# Altium schematic sheet Схема преобразователя.SchDoc
size 304 x 215 mm; SheetNumber: 1; SheetTotal: 1; SPICEModelCacheYOZEOBVT: <root> / <DocumentId>YOZEOBVT</DocumentId> / </root>; Normo_kontr: Фамилия; Proveril: Фамилия; Razrabotal: Васильев; Title2: название схемы (2 строка); Utverdil: Вертегел; Doc_Type_1str: Схема электрическая; Doc_Type_2str: принципиальная
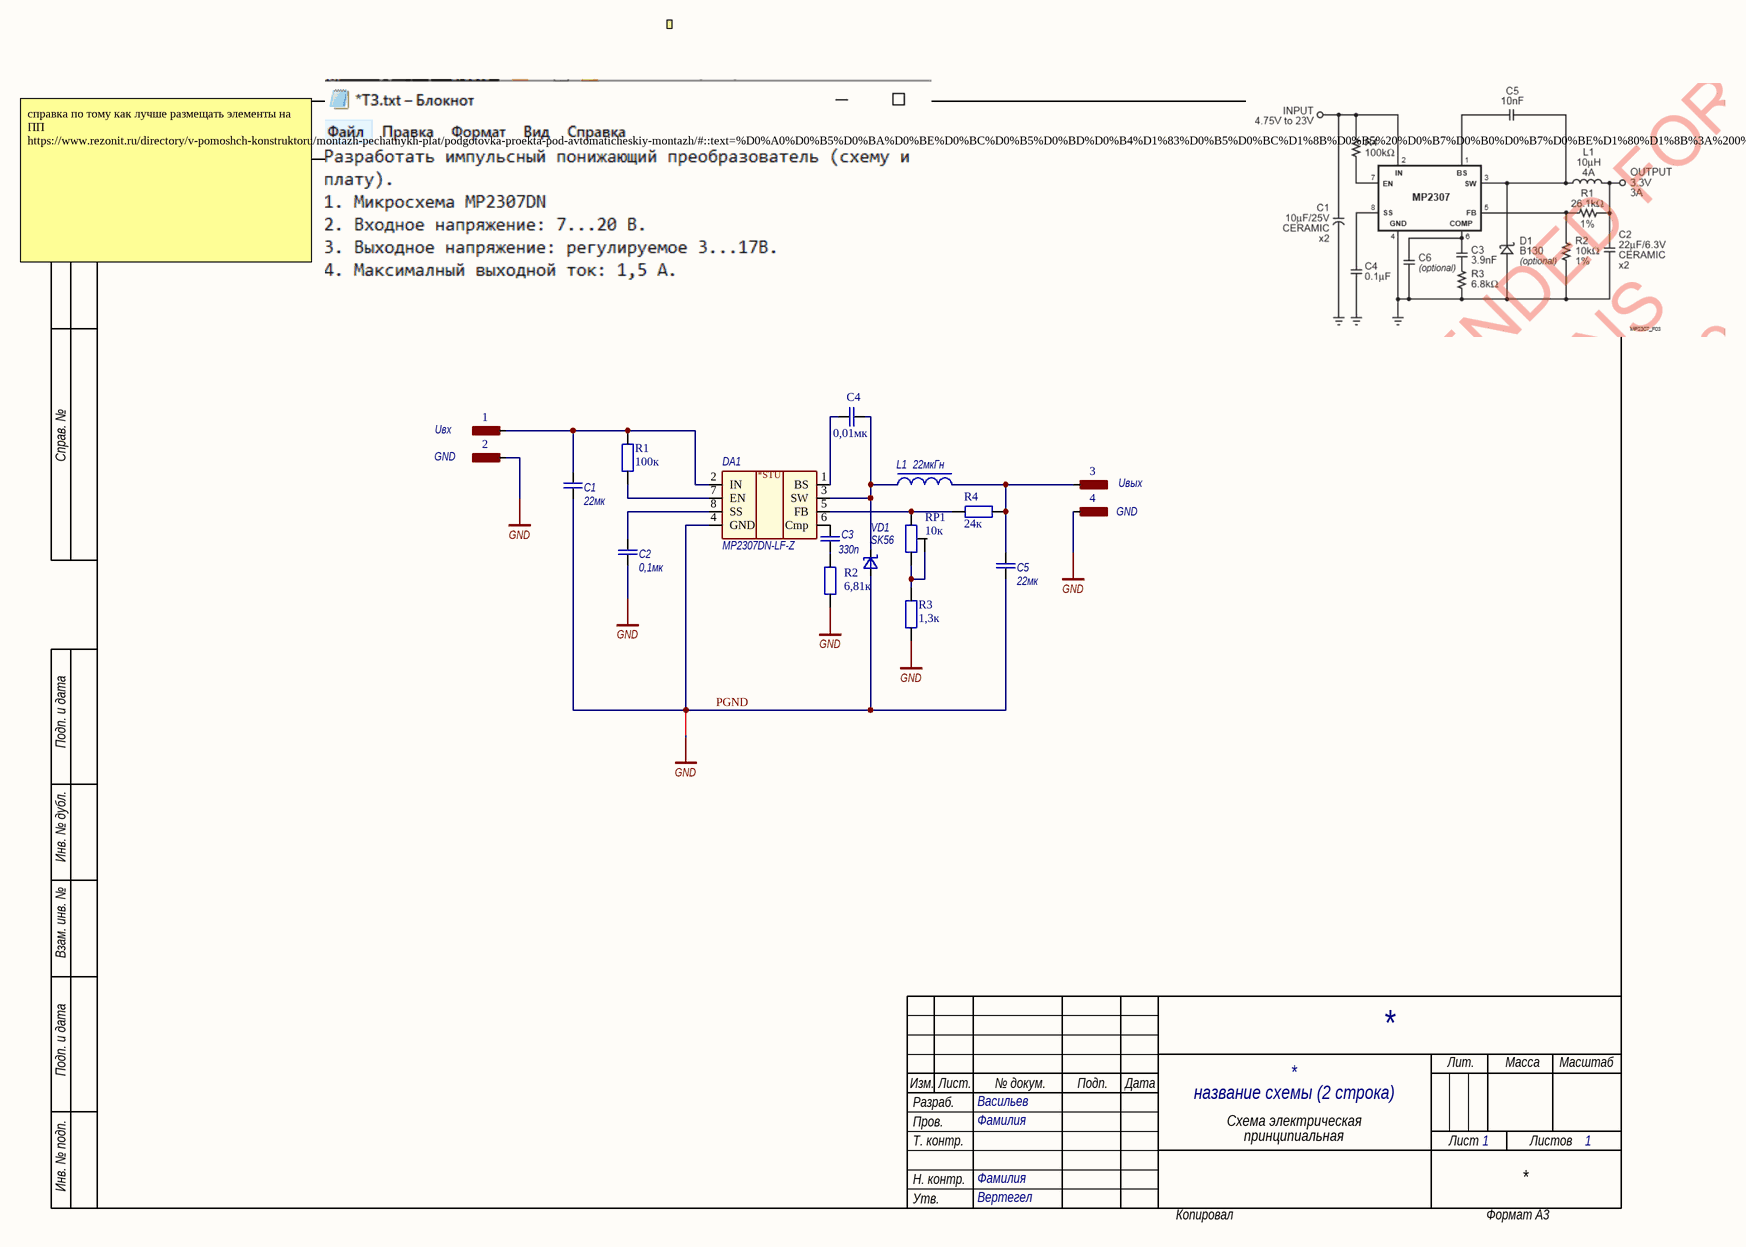
[diagram p0: Схема преобразователя.SchDoc]

## Parts
1  Контактная площадка  [Cont_point]  (value not drawn)  (no BOM)
2  Контактная площадка  [Cont_point]  (value not drawn)  (no BOM)
3  Контактная площадка  [Cont_point]  (value not drawn)  (no BOM)
4  Контактная площадка  [Cont_point]  (value not drawn)  (no BOM)
BR1  Соединение цепей  [BREAK_GND]  (value not drawn)  (net tie, no BOM)
C1  value 22мк  [C0805]  (hidden comment: CC0805MKX5R5BB476 (Yageo) SMD 0805-22мкФ±20% 25В X5R. -55°C ~ 85°C)
C2  value 0,1мк  [C0603]  (hidden comment: CGA3E2X7R1H104K080AA (TDK Corporation) SMD 0603-0,1мкФ±10% 50В X7R. -55°C ~ 125°C)
C3  value 330п  [C0603]  (hidden comment: GCM188R71C105MA64 (Murata) SMD 0603-1мкФ±20% 16В X7R. -55°C ~ 125°C)
C4  value 0,01мк  [C0603]  (hidden comment: GRM188R71H103KA01 (Murata) SMD 0603-0,01мкФ±10% 50В X7R. -55°C ~ 125°C)
C5  value 22мк  [C0805]  (hidden comment: CC0805MKX5R5BB476 (Yageo) SMD 0805-22мкФ±20% 25В X5R. -55°C ~ 85°C)
DA1  ManufacturerPartNumber: MP2307DN-LF-Z  [SO8_PowerPad]  (hidden comment: Микросхема MP2307DN-LF-Z)
L1  value 22мкГн  [VLS6045]  (hidden comment: Дроссель VLS6045EX-220M 22мкГн±20% 1,9А)
R1  value 100к  [R0603]  (hidden comment: 0603-100 кОм±5% SMD -60°C ~ 155°C)
R2  value 6,81к  [R0603]  (hidden comment: 0603-6,81 кОм±1% SMD -60°C ~ 155°C)
R3  value 1,3к  [R0603]  (hidden comment: 0603-1,2 кОм±5% SMD -60°C ~ 155°C)
R4  value 24к  [R0603]  (hidden comment: 0603-24 кОм±5% SMD -60°C ~ 155°C)
RP1  value 10к  [3296W]  (hidden comment: Резистор 3296W-1-202LF)
VD1  ManufacturerPartNumber: SK56  [DO214Aa]  (hidden comment: Диод Шоттки SK56)

## Nets
GND: 2.1 4.1 BR1.1 C2.2 R2.2 R3.2
PGND: BR1.2 C1.2 C5.2 DA1.4(GND) VD1.1(Анод)
Net1_1: 1.1 C1.1 DA1.2(IN) R1.1
Net3_1: 3.1 C5.1 L1.1 R4.2
NetC2_1: C2.1 DA1.8(SS)
NetC3_1: C3.1 DA1.6(Cmp)
NetC3_2: C3.2 R2.1
NetC4_1: C4.1 DA1.1(BS)
NetC4_2: C4.2 DA1.3(SW) L1.2 VD1.2(Катод)
NetDA1_5: DA1.5(FB) R4.1 RP1.3
NetDA1_7: DA1.7(EN) R1.2
NetR3_1: R3.1 RP1.1 RP1.2

## Notes on the sheet
- Text
- справка по тому как лучше размещать элементы на ПП https://www.rezonit.ru/directory/v-pomoshch-konstruktoru/montazh-pechatnykh-plat/podgotovka-proekta-pod-avtomaticheskiy-montazh/#::text=%D0%A0%D0%B5%D0%BA%D0%BE%D0%BC%D0%B5%D0%BD%D0%B4%D1%83%D0%B5%D0%BC%D1%8B%D0%B5%20%D0%B7%D0%B0%D0%B7%D0%BE%D1%80%D1%8B%3A%200%2C6.,SMD%20%D0%B8%20%D0%B2%D1%8B%D0%B2%D0%BE%D0%B4%D0%BD%D1%8B%D0%BC%D0%B8%20%D0%BA%D0%BE%D0%BC%D0%BF%D0%BE%D0%BD%D0%B5%D0%BD%D1%82%D0%B0%D0%BC%D0%B8%20(%D1%81%D0%BC.
- Uвх
- GND
- Uвых
- 1. Перепроверить расчёт C3/R2 (стр. 8-9 описания ИМС). +
  2. Заменить разъёмы контактными площадками.+
  3. Добавить разделение цепей. +
  4. R2 заменить на 0603 (вообще все C и R - на 0603, кроме С1 и С5). +
  5. RP1 заменить на 3296P (купим на Чайке). +
  6. Продумать, как включить в съему PR1, чтобы вращение по часовой увеличивало напряжение на выходе. +
  7. При разводке платы не забыть про: +
  - кольцевые токи,
  - делитель напряжения(расположить ближе к микросхеме).
  8. SMD компоненты - на одной стороне, подстроечный резистор - на другой. Вариант: поместить резистор плашмя и приклеить. Выводы изогнуть и подрезать (требует изменения футпринта). +
  9. Исправить шаблон эксель.
  10. Настроить генерацию BOM.
  11. Проверить, как всё работает :)
- Перв. примен.
- Справ. №
- Подп. и дата
- Инв. № дубл.
- Взам. инв. №
- Изм.
- Разраб.
- Лист.
- № докум.
- Подп.
- Дата
- Лит.
- Масса
- Масштаб
- Инв. № подп.
- Пров.
- Т. контр.
- Н. контр.
- Лист
- Листов
- Утв.
- Копировал
- Формат А3
- (in symbol DP0035) *STU

## Library data of the parts
1-4 = SPS0014: Контактная площадка на плате, 1,3х2 мм; ID: SPS0014; ClassName: *; Примечание: Контактная площадка
BR1 = SPS0002: Соединение разных типов земли или питания; Примечание: Специальный символ; ID: SPS0002; ClassName: *
C1 C5 = C0079: 0805, 22мк, ±20%, 25В, X5R; ID: C0079; Тип элемента: Конденсатор; Корпус: 0805; ВП/ОТК: Импорт; Name_for_setter: 0805-22мк±20%/25В--CC0805MKX5R5BB476 *** SMD; Тип расширенный: Конденсатор; Rem: SMD; SMD: SMD; Tolerance: ±20%; Power/Voltage: 25В; TKE: X5R; ManufacturerPartNumber: CC0805MKX5R5BB476; Manufacturer: Yageo; Operating Temperature: -55°C ~ 85°C; ClassName: *; Cost: 6,08; Примечание: Yageo; ComponentLink1Description: Параметры конденсатора (Yageo); ComponentLink1URL: D:/AltiumDoc/Library/Datasheets/Yageo/CC0805MKX5R8BB226.pdf; ComponentLink2Description: Сайт производителя; ComponentLink2URL: https://www.yageo.com/; ComponentLink3Description: Страница поставщика (Платан); ComponentLink3URL: https://www.platan.ru/cgi-bin/qwery.pl/id=2015146779; ComponentLink4Description: Описание конденсатора на сайте производителя; ComponentLink4URL: https://www.yageo.com/en/Chart/Download/pdf/CC0805MKX5R8BB226
C2 = C0011: 0603, 0,1мк, ±10%, 50В, X7R; ID: C0011; Тип элемента: Конденсатор; Корпус: 0603; ВП/ОТК: Импорт; Name_for_setter: 0603-0,1мк±10%/50В--CGA3E2X7R1H104K080AA *** SMD; Тип расширенный: Конденсатор; Rem: SMD; SMD: SMD; Tolerance: ±10%; Power/Voltage: 50В; TKE: X7R; ManufacturerPartNumber: CGA3E2X7R1H104K080AA; Manufacturer: TDK Corporation; Operating Temperature: -55°C ~ 125°C; ClassName: *; Cost: 6,3; Примечание: TDK Corporation; ComponentLink1Description: Каталог (TDK Corporation, автомобильное применение); ComponentLink1URL: D:/AltiumDoc/Library/Datasheets/TDK/mlcc_automotive_general_en.pdf; ComponentLink2Description: Сайт производителя; ComponentLink2URL: http://www.tdk.com/; ComponentLink4Description: Параметры конденсатора; ComponentLink4URL: D:/AltiumDoc/Library/Datasheets/TDK/mlccspec_automotive_general_midvoltage_en.pdf
C3 = C0041: 0603, 1мк, ±20%, 16В, X7R Automotive; ID: C0041; Тип элемента: Конденсатор; Корпус: 0603; ВП/ОТК: AEC-Q200; Name_for_setter: 0603-1мк±20%/16В--GCM188R71C105MA64 *** SMD; Тип расширенный: Конденсатор; Rem: SMD; SMD: SMD; Tolerance: ±20%; Power/Voltage: 16В; TKE: X7R; ManufacturerPartNumber: GCM188R71C105MA64; Manufacturer: Murata; Operating Temperature: -55°C ~ 125°C; ClassName: *; Cost: 20; Примечание: Murata; ComponentLink1Description: Параметры конденсатора (Murata, Automotive); ComponentLink1URL: D:/AltiumDoc/Library/Datasheets/Murata/GCM188R71C105KA64_.pdf; ComponentLink2Description: Сайт производителя; ComponentLink2URL: https://www.murata.com/; ComponentLink4Description: Описание конденсатора на сайте производителя (Murata); ComponentLink4URL: https://www.murata.com/en-global/products/productdetail.aspx?partno=GCM188R71C105KA64%23
C4 = C0038: 0603, 0,01мк, ±10%, 50В, X7R; ID: C0038; Тип элемента: Конденсатор; Корпус: 0603; ВП/ОТК: Импорт; Name_for_setter: 0603-0,01мк±10%/50В--GRM188R71H103KA01 *** SMD; Тип расширенный: Конденсатор; Rem: SMD; SMD: SMD; Tolerance: ±10%; Power/Voltage: 50В; TKE: X7R; ManufacturerPartNumber: GRM188R71H103KA01; Manufacturer: Murata; Operating Temperature: -55°C ~ 125°C; ClassName: *; Примечание: Murata; ComponentLink1Description: Параметры конденсатора (Murata); ComponentLink1URL: D:/AltiumDoc/Library/Datasheets/Murata/GRM188R71H103KA01_.pdf; ComponentLink2Description: Сайт производителя; ComponentLink2URL: https://www.murata.com/; ComponentLink4Description: Описание конденсатора на сайте производителя (Murata); ComponentLink4URL: https://www.murata.com/en-eu/products/productdetail?partno=GRM188R71H103KA01%23; Cost: 3; ComponentLink3Description: Страница поставщика (Чип и Дип); ComponentLink3URL: https://www.chipdip.ru/product/grm188r71h103k
DA1 = DP0035: DC/DC пониж. преобр., Вх(4,75-23В), вых - 3А, 340 кГц, SMD. NRFND!!!; Manufacturer: MPS; ID: DP0035; Корпус: SO8-PowPad; ВП/ОТК: Импорт; Name_for_setter: MP2307DN-LF-Z *** DIR***SMD; Тип элемента: Микросхема; Тип расширенный: Микросхема; Rem: DC/DC; DIR: DIR; SMD: SMD; Operating Temperature: -40°C ~ 85°C; Storage Temperature: -65°C ~ 150°C; ОКП: импорт; ClassName: *; Cost: 130; Примечание: MPS; ComponentLink1Description: Параметры DC/DC преобразователя (MPS); ComponentLink1URL: D:/AltiumDoc/Library/Datasheets/MPS/MP2307.pdf; ComponentLink2Description: Сайт производителя; ComponentLink2URL: https://www.monolithicpower.com/en/; ComponentLink3Description: Сайт поставщика (Чип и Дип); ComponentLink3URL: https://www.chipdip.ru/product/mp2307dn; ComponentLink4Description: Страница на сайте производителя; ComponentLink4URL: https://www.monolithicpower.com/en/mp2307.html
L1 = LL0009: Дроссель 22мкГн, корпус - VLS6045; Manufacturer: TDK; ID: LL0009; Rem: Induct; ВП/ОТК: Импорт; Tolerance: ±20%; Power/Voltage: 1,9А; Name_for_setter: -22мкГн±20% 1,9А--VLS6045EX-220M *** SMD; Тип элемента: Дроссель; Тип расширенный: Дроссель; SMD: SMD; ManufacturerPartNumber: VLS6045EX-220M; Operating Temperature: -40°C ~ 105°C; ОКП: импорт; ClassName: *; Cost: 32; Примечание: TDK; ComponentLink1Description: Параметры дросселя (TDK); ComponentLink1URL: D:/AltiumDoc/Library/Datasheets/TDK/inductor_commercial_power_vls6045ex_en.pdf; ComponentLink2Description: Сайт производителя; ComponentLink2URL: https://product.tdk.com/info/en/index.html; ComponentLink3Description: Страница поставщика (Чип и Дип); ComponentLink3URL: https://www.chipdip.ru/product/vls6045ex-220m-22; ComponentLink4Description: Страница на сайте производиетеля; ComponentLink4URL: https://product.tdk.com/en/search/inductor/inductor/smd/info?part_no=VLS6045EX-100M&utm_source=inductor_commercial_power_vls6045ex_en.pdf&utm_medium=catalog
R1 = R0236: Общего применения, 5%; ManufacturerPartNumber: Р1-12-0,1-100 кОм±5%; Manufacturer: Ресурс; ID: R0236; Тип элемента: Резистор; Корпус: 0603; ВП/ОТК: ОТК; Power/Voltage: 0,1Вт; TKE: ±100; Name_for_setter: 0603-100к±5%/0,1Вт--Р1-12-0,1-100 кОм±5% *** SMD; ТУ: ШКАБ.434110.024 ТУ; ОКП: 601000; Тип расширенный: Резистор; Rem: SMD; SMD: SMD; Tolerance: ±5%; Operating Temperature: -60°C ~ 155°C; ClassName: *; Cost: 3,4; Примечание: *; ComponentLink1Description: Параметры резисторов серии Р1-12 ОТК (0.1Вт, АО "Ресурс"); ComponentLink1URL: D:/AltiumDoc/Library/Datasheets/Resurs/R1_12-SHKAB.434110.024TU.pdf; ComponentLink2Description: Сайт производителя; ComponentLink2URL: https://aoresurs.com/; ComponentLink4Description: Протокол цены; ComponentLink4URL: D:/AltiumDoc/Library/Datasheets/Resurs/preiskurant_Р1-12 ШКАБ.434110.024 ТУ.PDF; ComponentLink5Description: Страница на сайте производителя; ComponentLink5URL: https://aoresurs.com/catalog/chip_rezistory/rezistory-r1-12-priemka-otk/
R2 = R0094: Общего применения, 1%; ManufacturerPartNumber: Р1-8В-0,1-6,81 кОм±1%-Т-А-М; Manufacturer: ЭРКОН; ID: R0094; Тип элемента: Резистор; Корпус: 0603; ВП/ОТК: ВП; Power/Voltage: 0,1Вт; TKE: ±250; Name_for_setter: 0603-6,81к±1%/0,1Вт--Р1-8В-0,1-6,81 кОм±1%-Т-А-М *** SMD; ТУ: ОЖ0.467.164 ТУ; ОКП: 601000; Тип расширенный: Резистор; Rem: SMD; SMD: SMD; Tolerance: ±1%; Operating Temperature: -60°C ~ 155°C; ClassName: *; Cost: 9,24; Примечание: *; ComponentLink1Description: Параметры резисторов серии Р1-8В (0.1Вт, Эркон); ComponentLink1URL: D:/AltiumDoc/Library/Datasheets/Erkon/Resistors/r1_8v.pdf; ComponentLink2Description: Сайт производителя; ComponentLink2URL: http://www.erkon-nn.ru/; ComponentLink4Description: Протокол цены; ComponentLink4URL: D:/AltiumDoc/Library/Datasheets/Erkon/Resistors/Protokol_tsen_R1-8V.pdf
R3 = R0215: Общего применения, 5%; ManufacturerPartNumber: Р1-12-0,1-1,2 кОм±5%; Manufacturer: Ресурс; ID: R0215; Тип элемента: Резистор; Корпус: 0603; ВП/ОТК: ОТК; Power/Voltage: 0,1Вт; TKE: ±100; ТУ: ШКАБ.434110.024 ТУ; ОКП: 601000; Name_for_setter: 0603-1,2к±5%/0,1Вт--Р1-12-0,1-1,2 кОм±5% *** SMD; Тип расширенный: Резистор; Rem: SMD; SMD: SMD; Tolerance: ±5%; Operating Temperature: -60°C ~ 155°C; ClassName: *; Cost: 3,4; Примечание: *; ComponentLink1Description: Параметры резисторов серии Р1-12 ОТК (0.1Вт, АО "Ресурс"); ComponentLink1URL: D:/AltiumDoc/Library/Datasheets/Resurs/R1_12-SHKAB.434110.024TU.pdf; ComponentLink2Description: Сайт производителя; ComponentLink2URL: https://aoresurs.com/; ComponentLink4Description: Протокол цены; ComponentLink4URL: D:/AltiumDoc/Library/Datasheets/Resurs/preiskurant_Р1-12 ШКАБ.434110.024 ТУ.PDF; ComponentLink5Description: Страница на сайте производителя; ComponentLink5URL: https://aoresurs.com/catalog/chip_rezistory/rezistory-r1-12-priemka-otk/
R4 = R0091: Общего применения, 5%; ManufacturerPartNumber: Р1-8В-0,1-24 кОм±5%-Т-А-М; Manufacturer: ЭРКОН; ID: R0091; Тип элемента: Резистор; Корпус: 0603; ВП/ОТК: ВП; Power/Voltage: 0,1Вт; TKE: ±250; ТУ: ОЖ0.467.164 ТУ; ОКП: 601000; Name_for_setter: 0603-24к±5%/0,1Вт--Р1-8В-0,1-24 кОм±5%-Т-А-М *** SMD; Тип расширенный: Резистор; Rem: SMD; SMD: SMD; Tolerance: ±5%; Operating Temperature: -60°C ~ 155°C; ClassName: *; Cost: 9,24; Примечание: *; ComponentLink1Description: Параметры резисторов серии Р1-8В (0.1Вт, Эркон); ComponentLink1URL: D:/AltiumDoc/Library/Datasheets/Erkon/Resistors/r1_8v.pdf; ComponentLink2Description: Сайт производителя; ComponentLink2URL: http://www.erkon-nn.ru/; ComponentLink4Description: Протокол цены; ComponentLink4URL: D:/AltiumDoc/Library/Datasheets/Erkon/Resistors/Protokol_tsen_R1-8V.pdf
RP1 = RA0003: Резистор подстроечный многооборотный 10к 0.5Вт Bourns; ID: RA0003; Rem: ADJ; ВП/ОТК: Импорт; Tolerance: ±20%; Name_for_setter: 3296W-1-202LF *** DIR; Тип элемента: Резистор; Тип расширенный: Резистор подстроечный многооборотный; Корпус: 3296W; DIR: DIR; Power/Voltage: 0.5Вт; ManufacturerPartNumber: 3296W-1-202LF; Manufacturer: Bourns; Operating Temperature: -65°C ~ 150°C; ClassName: *; Cost: 60; Примечание: Bourns; ComponentLink1Description: Описание многооборотного резистора (Bourns); ComponentLink1URL: D:/AltiumDoc/Library/Datasheets/Bourns/Resistors_3296-series.pdf; ComponentLink2Description: Сайт производителя; ComponentLink2URL: https://www.bourns.com/; ComponentLink3Description: Страница поставщика (Чип и Дип); ComponentLink3URL: https://www.chipdip.ru/product/3296w-1-202
VD1 = VD0025: Диод Шоттки SK56 (SMD, 60В / 5А); Manufacturer: Diotec Semiconductor; ID: VD0025; Rem: Shottky Diode; Корпус: DO-214AA; ВП/ОТК: Импорт; Name_for_setter: SK56 *** DIR *** SMD; Тип элемента: Диод; Тип расширенный: Диод Шоттки; DIR: DIR; SMD: SMD; Operating Temperature: -50°C ~ 150°C; Storage Temperature: -50°C ~ 150°C; ОКП: импорт; ClassName: *; Cost: 10; Примечание: Diotec Semiconductor; ComponentLink1Description: Параметры диода Шоттки (Diotec Semiconductor); ComponentLink1URL: D:/AltiumDoc/Library/Datasheets/Diotec_Semiconductor/sk52_SK515.pdf; ComponentLink2Description: Сайт производителя; ComponentLink2URL: https://diotec.com/; ComponentLink3Description: Страница поставщика (Чип и Дип); ComponentLink3URL: https://www.chipdip.ru/product/sk56